# Altium project flyControl.PrjPcb
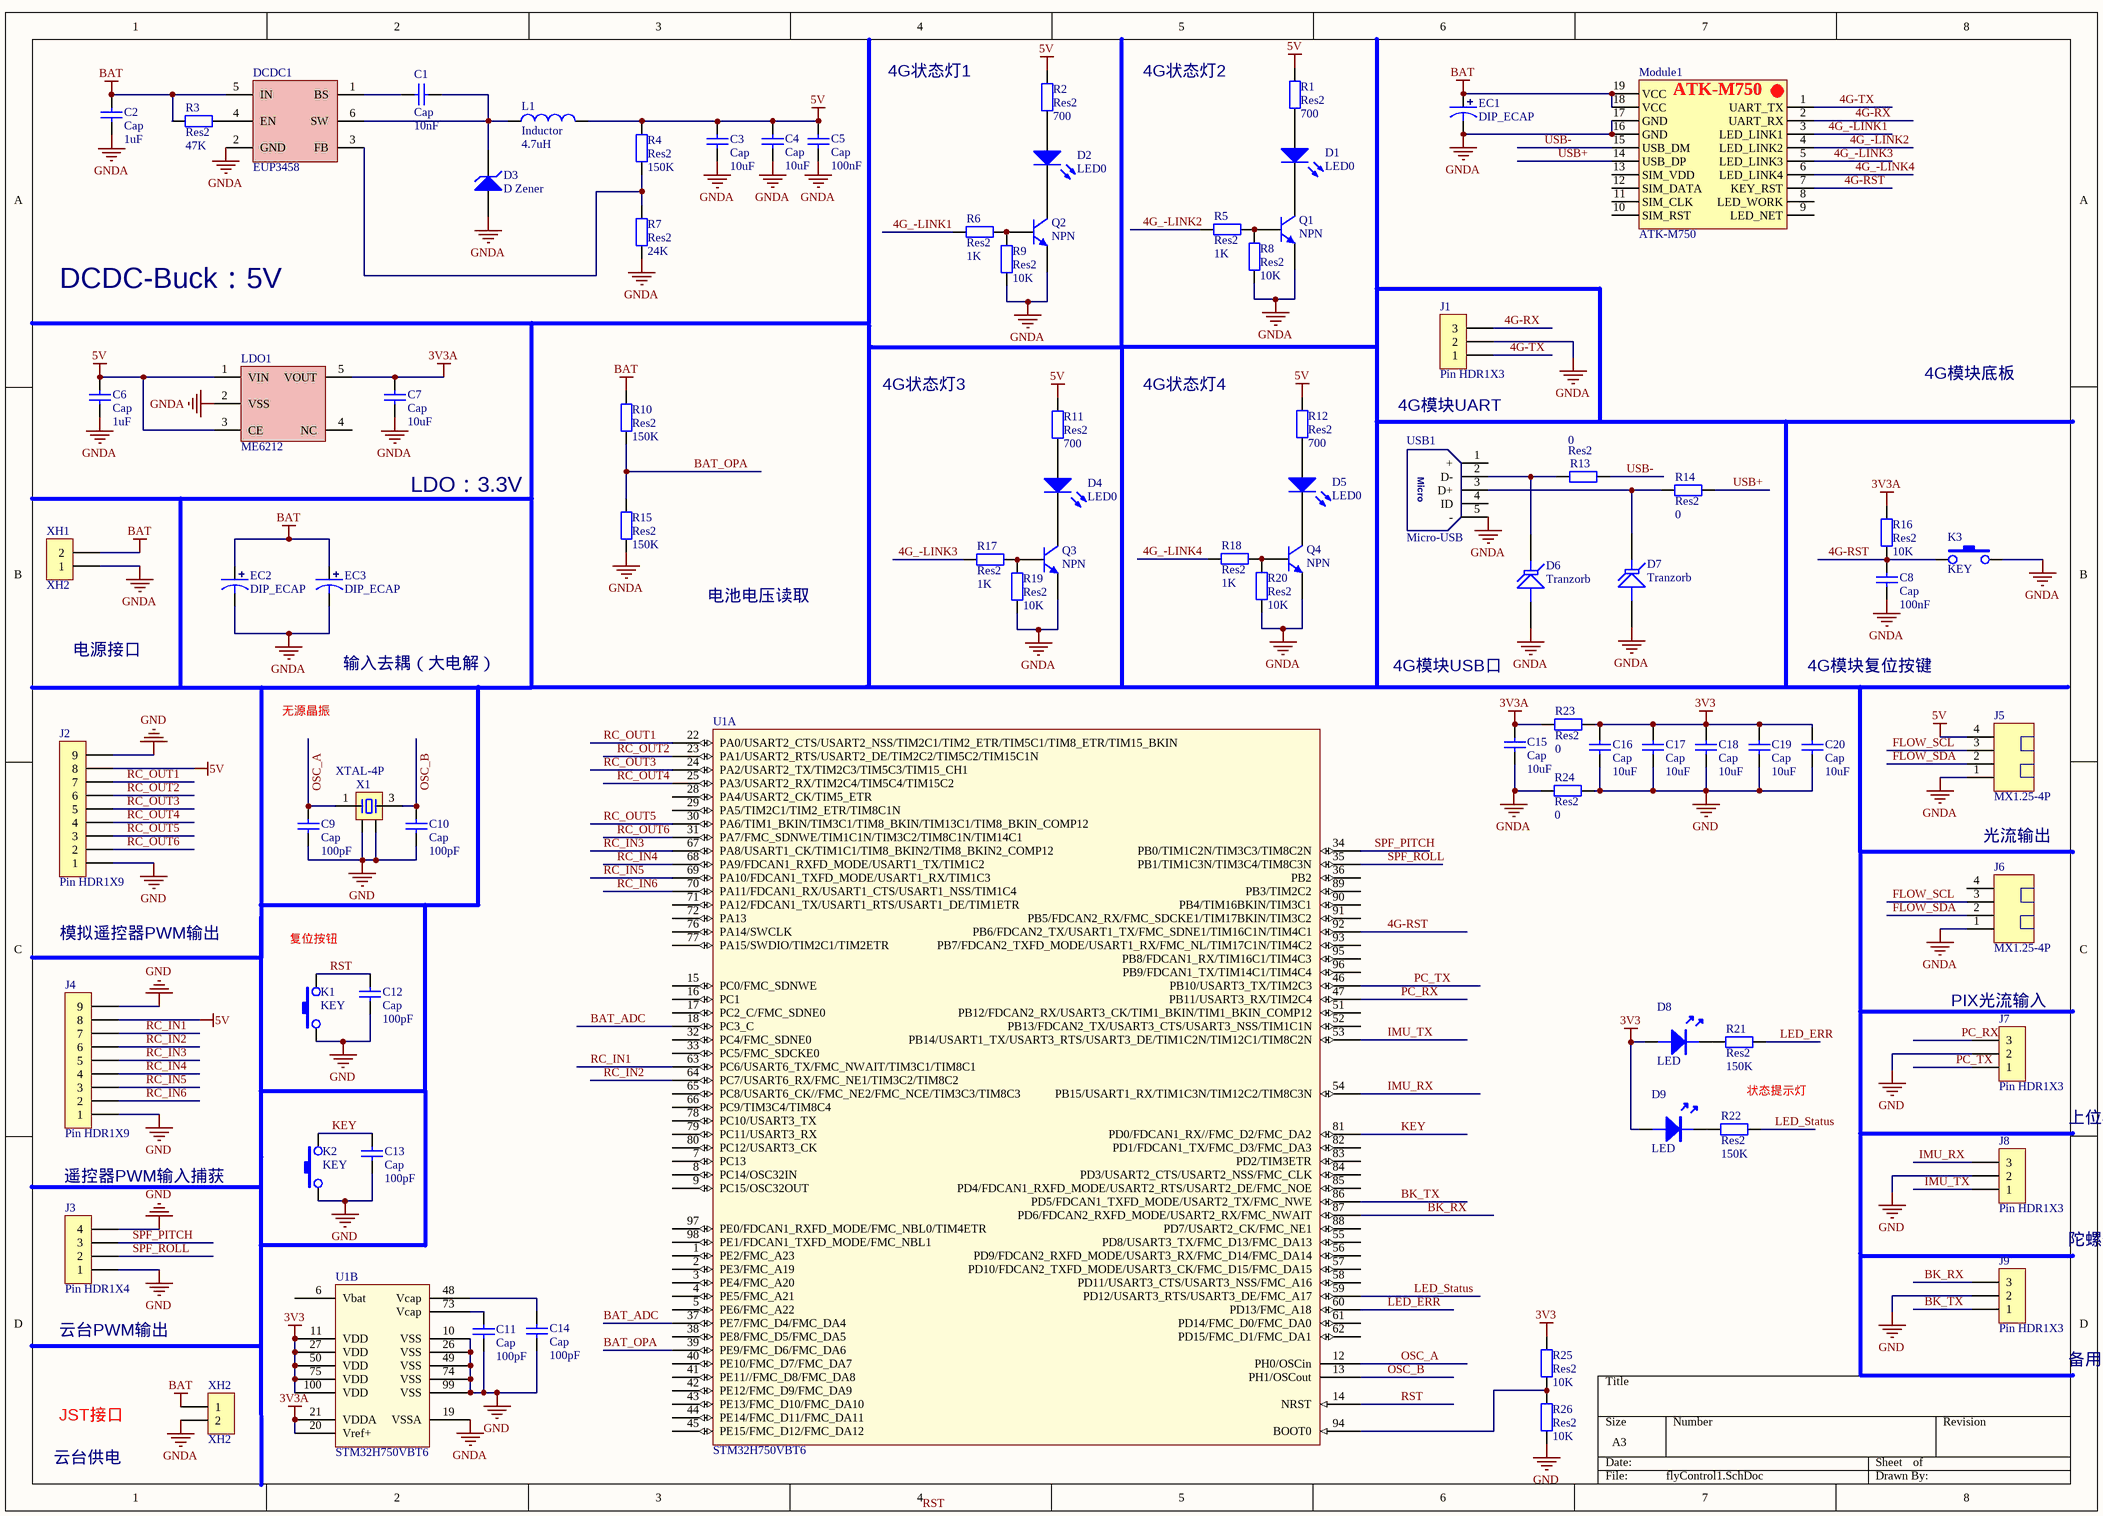
[diagram p0: flyControl1.SchDoc]
1 sheet, 83 parts. Net scope: global (net labels, ports and power ports of the same name join across sheets).
Board file: flyControl1.PcbDoc

## Sheet flyControl1.SchDoc
size A3

### Parts
C1  Cap  value 10nF  [0603C]
C2  Cap  value 1uF  [0805C]
C3  Cap  value 10uF  [0603C]
C4  Cap  value 10uF  [0603C]
C5  Cap  value 100nF  [0603C]
C6  Cap  value 1uF  [0603C]
C7  Cap  value 10uF  [0603C]
C8  Cap  value 100nF  [0603C]
C9  Cap  value 100pF  [0603C]
C10  Cap  value 100pF  [0603C]
C11  Cap  value 100pF  [0603C]
C12  Cap  value 100pF  [0603C]
C13  Cap  value 100pF  [0603C]
C14  Cap  value 100pF  [0603C]
C15  Cap  value 10uF  [0603C]
C16  Cap  value 10uF  [0603C]
C17  Cap  value 10uF  [0603C]
C18  Cap  value 10uF  [0603C]
C19  Cap  value 10uF  [0603C]
C20  Cap  value 10uF  [0603C]
D1  LED0  [LED-0603G]
D2  LED0  [LED-0603G]
D3  D Zener  [SMA/DO-214AC]
D4  LED0  [LED-0603G]
D5  LED0  [LED-0603G]
D6  Tranzorb  [SMA/DO-214AC]
D7  Tranzorb  [SMA/DO-214AC]
D8  LED  [LED-0603G]
D9  LED  [LED-0603G]
DCDC1  EUP3458  [SOT23-6]
EC1  DIP_ECAP  [DIP-EC1.5X4X8]
EC2  DIP_ECAP  [DIP-EC5.0X10X20]
EC3  DIP_ECAP  [DIP-EC5.0X10X20]
J1  Pin HDR1X3  [Pin HDR1X3/2.54mm-W]
J2  Pin HDR1X9  [Pin HDR1X9/2.54mm-W]
J3  Pin HDR1X4  [Pin HDR1X4/2.54mm-W]
J4  Pin HDR1X9  [Pin HDR1X9/2.54mm-W]
J5  MX1.25-4P  [MX1.25WS-4P]
J6  MX1.25-4P  [MX1.25WS-4P]
J7  Pin HDR1X3  [Pin HDR1X3/2.54mm-W]
J8  Pin HDR1X3  [Pin HDR1X3/2.54mm-W]
J9  Pin HDR1X3  [Pin HDR1X3/2.54mm-W]
K1  KEY  [SMD-3X6X2.5]
K2  KEY  [SMD-3X6X2.5]
K3  KEY  [SMD-3X6X2.5]
L1  Inductor  value 4.7uH  [NR3015]
LDO1  ME6212  [SOT23-5]
Module1  ATK-M750  [ATK-M750-V1.0]
Q1  NPN  [SOT-23]
Q2  NPN  [SOT-23]
Q3  NPN  [SOT-23]
Q4  NPN  [SOT-23]
R1  Res2  value 700  [0603R]
R2  Res2  value 700  [0603R]
R3  Res2  value 47K  [0603R]
R4  Res2  value 150K  [0603R]
R5  Res2  value 1K  [0603R]
R6  Res2  value 1K  [0603R]
R7  Res2  value 24K  [0603R]
R8  Res2  value 10K  [0603R]
R9  Res2  value 10K  [0603R]
R10  Res2  value 150K  [0603R]
R11  Res2  value 700  [0603R]
R12  Res2  value 700  [0603R]
R13  Res2  value 0  [0603R]
R14  Res2  value 0  [0603R]
R15  Res2  value 150K  [0603R]
R16  Res2  value 10K  [0603R]
R17  Res2  value 1K  [0603R]
R18  Res2  value 1K  [0603R]
R19  Res2  value 10K  [0603R]
R20  Res2  value 10K  [0603R]
R21  Res2  value 150K  [0603R]
R22  Res2  value 150K  [0603R]
R23  Res2  value 0  [0603R]
R24  Res2  value 0  [0603R]
R25  Res2  value 10K  [0603R]
R26  Res2  value 10K  [0603R]
U1  STM32H750VBT6  [QFP50P1600X1600X160-100N]  (parts A,B of 2)
USB1  Micro-USB  [USB-MICRO_D]
X1  XTAL-4P  [OSC 3225-4P]
XH1  XH2  [XH2/2.54mm/90]
XH2  XH2  [XH2/2.54mm/90]

### Nets
3V3: C16.2 C17.2 C18.2 C19.2 C20.2 D8.A D9.A R23.2 R25.2 U1.11(VDD) U1.27(VDD) U1.50(VDD) U1.75(VDD) U1.100(VDD)
3V3A: C7.2 C15.2 LDO1.5(VOUT) R16.2 R23.1 U1.20(Vref+) U1.21(VDDA)
5V: C3.2 C4.2 C5.2 C6.2 J2.8 J4.8 J5.4 L1.2 LDO1.1(VIN) LDO1.3(CE) R1.2 R2.2 R4.2 R11.2 R12.2
BAT: C2.2 DCDC1.5(IN) EC1.1 EC2.1 EC3.1 Module1.18(VCC) Module1.19(VCC) R3.1 R10.2 XH1.2 XH2.1
GND: C9.2 C10.1 C11.1 C12.1 C13.1 C14.1 C16.1 C17.1 C18.1 C19.1 C20.1 J2.1 J2.9 J3.1 J3.4 J4.1 J4.9 J7.2 J8.2 J9.2 K1.1 K2.1 R24.2 R26.2 U1.10(VSS) U1.26(VSS) U1.49(VSS) U1.74(VSS) U1.99(VSS) X1.2 X1.4
GNDA: C2.1 C3.1 C4.1 C5.1 C6.1 C7.1 C8.1 C15.1 D3.1(A) D6.1(A) D7.1(A) DCDC1.2(GND) EC1.2 EC2.2 EC3.2 J1.2 J5.1 J6.1 K3.3 LDO1.2(VSS) Module1.16(GND) Module1.17(GND) Q1.3(E) Q2.3(E) Q3.3(E) Q4.3(E) R7.1 R8.2 R9.2 R15.1 R19.2 R20.2 R24.1 U1.19(VSSA) USB1.5(-) XH1.1 XH2.2
4G-RST: C8.2 K3.1 Module1.7(KEY_RST) R16.1 U1.92(PB6/FDCAN2_TX/USART1_TX/FMC_SDNE1/TIM16C1N/TIM4C1)
4G-RX: J1.3 Module1.2(UART_RX)
4G-TX: J1.1 Module1.1(UART_TX)
4G_-LINK1: Module1.3(LED_LINK1) R6.2
4G_-LINK2: Module1.4(LED_LINK2) R5.2
4G_-LINK3: Module1.5(LED_LINK3) R17.2
4G_-LINK4: Module1.6(LED_LINK4) R18.2
BAT_ADC: U1.18(PC3_C) U1.37(PE7/FMC_D4/FMC_DA4)
BAT_OPA: R10.1 R15.2 U1.39(PE9/FMC_D6/FMC_DA6)
BK_RX: J9.3 U1.87(PD6/FDCAN2_RXFD_MODE/USART2_RX/FMC_NWAIT)
BK_TX: J9.1 U1.86(PD5/FDCAN1_TXFD_MODE/USART2_TX/FMC_NWE)
FLOW_SCL: J5.3 J6.3
FLOW_SDA: J5.2 J6.2
IMU_RX: J8.3 U1.54(PB15/USART1_RX/TIM1C3N/TIM12C2/TIM8C3N)
IMU_TX: J8.1 U1.53(PB14/USART1_TX/USART3_RTS/USART3_DE/TIM1C2N/TIM12C1/TIM8C2N)
KEY: C13.2 K2.3 U1.81(PD0/FDCAN1_RX//FMC_D2/FMC_DA2)
LED_ERR: R21.1 U1.60(PD13/FMC_A18)
LED_Status: R22.1 U1.59(PD12/USART3_RTS/USART3_DE/FMC_A17)
OSC_A: C9.1 U1.12(PH0/OSCin) X1.1
OSC_B: C10.2 U1.13(PH1/OSCout) X1.3
PC_RX: J7.3 U1.47(PB11/USART3_RX/TIM2C4)
PC_TX: J7.1 U1.46(PB10/USART3_TX/TIM2C3)
RC_IN1: J4.7 U1.63(PC6/USART6_TX/FMC_NWAIT/TIM3C1/TIM8C1)
RC_IN2: J4.6 U1.64(PC7/USART6_RX/FMC_NE1/TIM3C2/TIM8C2)
RC_IN3: J4.5 U1.67(PA8/USART1_CK/TIM1C1/TIM8_BKIN2/TIM8_BKIN2_COMP12)
RC_IN4: J4.4 U1.68(PA9/FDCAN1_RXFD_MODE/USART1_TX/TIM1C2)
RC_IN5: J4.3 U1.69(PA10/FDCAN1_TXFD_MODE/USART1_RX/TIM1C3)
RC_IN6: J4.2 U1.70(PA11/FDCAN1_RX/USART1_CTS/USART1_NSS/TIM1C4)
RC_OUT1: J2.7 U1.22(PA0/USART2_CTS/USART2_NSS/TIM2C1/TIM2_ETR/TIM5C1/TIM8_ETR/TIM15_BKIN)
RC_OUT2: J2.6 U1.23(PA1/USART2_RTS/USART2_DE/TIM2C2/TIM5C2/TIM15C1N)
RC_OUT3: J2.5 U1.24(PA2/USART2_TX/TIM2C3/TIM5C3/TIM15_CH1)
RC_OUT4: J2.4 U1.25(PA3/USART2_RX/TIM2C4/TIM5C4/TIM15C2)
RC_OUT5: J2.3 U1.30(PA6/TIM1_BKIN/TIM3C1/TIM8_BKIN/TIM13C1/TIM8_BKIN_COMP12)
RC_OUT6: J2.2 U1.31(PA7/FMC_SDNWE/TIM1C1N/TIM3C2/TIM8C1N/TIM14C1)
RST: C12.2 K1.3 U1.14(NRST)
SPF_PITCH: J3.3 U1.34(PB0/TIM1C2N/TIM3C3/TIM8C2N)
SPF_ROLL: J3.2 U1.35(PB1/TIM1C3N/TIM3C4/TIM8C3N)
USB+: Module1.14(USB_DP) R14.2
USB-: Module1.15(USB_DM) R13.2
NetC1_1: C1.1 DCDC1.1(BS)
NetC1_2: C1.2 D3.2(K) DCDC1.6(SW) L1.1
NetC11_2: C11.2 U1.73(Vcap)
NetC14_2: C14.2 U1.48(Vcap)
NetD1_1: D1.1(A) R1.1
NetD1_2: D1.2(K) Q1.1(C)
NetD2_1: D2.1(A) R2.1
NetD2_2: D2.2(K) Q2.1(C)
NetD4_1: D4.1(A) R11.1
NetD4_2: D4.2(K) Q3.1(C)
NetD5_1: D5.1(A) R12.1
NetD5_2: D5.2(K) Q4.1(C)
NetD6_2: D6.2(K) R13.1 USB1.2(D-)
NetD7_2: D7.2(K) R14.1 USB1.3(D+)
NetD8_K: D8.K R21.2
NetD9_K: D9.K R22.2
NetDCDC1_3: DCDC1.3(FB) R4.1 R7.2
NetDCDC1_4: DCDC1.4(EN) R3.2
NetQ1_2: Q1.2(B) R5.1 R8.1
NetQ2_2: Q2.2(B) R6.1 R9.1
NetQ3_2: Q3.2(B) R17.1 R19.1
NetQ4_2: Q4.2(B) R18.1 R20.1
NetR25_1: R25.1 R26.1 U1.94(BOOT0)

Not connected (* = marked no-connect by the designer): J6 4; LDO1 4(NC); Module1 8(LED_WORK) 9(LED_NET) 10(SIM_RST) 11(SIM_CLK) 12(SIM_DATA) 13(SIM_VDD); U1 1(PE2/FMC_A23) 2(PE3/FMC_A19) 3(PE4/FMC_A20) 4(PE5/FMC_A21) 5(PE6/FMC_A22) 6(Vbat) 7(PC13) 8(PC14/OSC32IN) 9(PC15/OSC32OUT) 15(PC0/FMC_SDNWE) 16(PC1) 17(PC2_C/FMC_SDNE0) 28(PA4/USART2_CK/TIM5_ETR) 29(PA5/TIM2C1/TIM2_ETR/TIM8C1N) 32(PC4/FMC_SDNE0) 33(PC5/FMC_SDCKE0) 36(PB2) 38(PE8/FMC_D5/FMC_DA5) 40(PE10/FMC_D7/FMC_DA7) 41(PE11//FMC_D8/FMC_DA8) 42(PE12/FMC_D9/FMC_DA9) 43(PE13/FMC_D10/FMC_DA10) 44(PE14/FMC_D11/FMC_DA11) 45(PE15/FMC_D12/FMC_DA12) 51(PB12/FDCAN2_RX/USART3_CK/TIM1_BKIN/TIM1_BKIN_COMP12) 52(PB13/FDCAN2_TX/USART3_CTS/USART3_NSS/TIM1C1N) 55(PD8/USART3_TX/FMC_D13/FMC_DA13) 56(PD9/FDCAN2_RXFD_MODE/USART3_RX/FMC_D14/FMC_DA14) 57(PD10/FDCAN2_TXFD_MODE/USART3_CK/FMC_D15/FMC_DA15) 58(PD11/USART3_CTS/USART3_NSS/FMC_A16) 61(PD14/FMC_D0/FMC_DA0) 62(PD15/FMC_D1/FMC_DA1) 65(PC8/USART6_CK//FMC_NE2/FMC_NCE/TIM3C3/TIM8C3) 66(PC9/TIM3C4/TIM8C4) 71(PA12/FDCAN1_TX/USART1_RTS/USART1_DE/TIM1ETR) 72(PA13) 76(PA14/SWCLK) 77(PA15/SWDIO/TIM2C1/TIM2ETR) 78(PC10/USART3_TX) 79(PC11/USART3_RX) 80(PC12/USART3_CK) 82(PD1/FDCAN1_TX/FMC_D3/FMC_DA3) 83(PD2/TIM3ETR) 84(PD3/USART2_CTS/USART2_NSS/FMC_CLK) 85(PD4/FDCAN1_RXFD_MODE/USART2_RTS/USART2_DE/FMC_NOE) 88(PD7/USART2_CK/FMC_NE1) 89(PB3/TIM2C2) 90(PB4/TIM16BKIN/TIM3C1) 91(PB5/FDCAN2_RX/FMC_SDCKE1/TIM17BKIN/TIM3C2) 93(PB7/FDCAN2_TXFD_MODE/USART1_RX/FMC_NL/TIM17C1N/TIM4C2) 95(PB8/FDCAN1_RX/TIM16C1/TIM4C3) 96(PB9/FDCAN1_TX/TIM14C1/TIM4C4) 97(PE0/FDCAN1_RXFD_MODE/FMC_NBL0/TIM4ETR) 98(PE1/FDCAN1_TXFD_MODE/FMC_NBL1); USB1 1(+) 4(ID)

### Notes on the sheet
- 4G状态灯1
- 4G状态灯2
- DCDC-Buck：5V
- 4G状态灯3
- 4G状态灯4
- 4G模块底板
- 4G模块UART
- LDO：3.3V
- 电源接口
- 电池电压读取
- 无源晶振
- 输入去耦（大电解）
- 4G模块USB口
- 4G模块复位按键
- 光流输出
- 模拟遥控器PWM输出
- (near K1) 复位按钮
- (near J7) PIX光流输入
- 状态提示灯
- 上位机UART
- 遥控器PWM输入捕获
- 陀螺仪UART
- (near J3) 云台PWM输出
- (near J9) 备用UART
- 云台供电
- JST接口
- Labels drawn without touching a wire or pin: RST
- (in symbol Micro-USB) Micro

### Library data of the parts
C1-C20 = Cap: Capacitor; Published: 8-Jun-2000; LatestRevisionDate: 17-Jul-2002; LatestRevisionNote: Re-released for DXP Platform.; PackageReference: RAD-0.3; Publisher: Altium Limited; PackageDescription: Radial Cap, Thru-Hole; 2 Leads; 0.3 in Pin Spacing
D1 D2 D4 D5 = LED0: Typical INFRARED GaAs LED; pin to pad: 1>A 2>K; Published: 8-Jun-2000; LatestRevisionDate: 08-Jul-2005; LatestRevisionNote: Mech Layer 1 removed.; PackageReference: LED-0; Publisher: Altium Limited; PackageDescription: LED; 2 Leads
D3 = D Zener: Zener Diode; pin to pad: 1>A 2>K; Published: 8-Jun-2000; LatestRevisionDate: 17-Jul-2002; LatestRevisionNote: Re-released for DXP Platform.; PackageReference: DIODE-0.7; Publisher: Altium Limited; PackageDescription: Diode, Thru-Hole; 2 Leads; 0.7 in Pin Spacing
D6 D7 = Tranzorb: Transient Voltage Suppression (TVS) Diode; pin to pad: 1>A 2>K; Published: 24-Mar-1999; LatestRevisionDate: 17-Jul-2002; LatestRevisionNote: Re-released for DXP Platform.; PackageReference: DO-7; Publisher: Altium Limited; PackageDescription: Axial Lead Diode
D8 D9 = LED: pin to pad: 1>A 2>K
DCDC1 = EUP3458: 同步DCDC，30Vmax，1.2MHz，输出最大15V@1.2A
EC1-EC3 = DIP_ECAP: 直插电解电容
J5 J6 = MX1.25-4P: pin to pad: 1>4 2>3 3>2 4>1
L1 = Inductor: Code_IEC: 1005; Published: 8-Jun-2000; LatestRevisionDate: 29-May-2009; LatestRevisionNote: IPC-7351 Footprint Added.; PackageReference: 0402-A; Publisher: Altium Limited; PackageDescription: Chip Inductor; Code_JEITA: 0402
LDO1 = ME6212: 3.3V小体积LDO，最大电流350mA
Module1 = ATK-M750: 正点原子ATK-M750(4G DTU)
Q1-Q4 = NPN: NPN Bipolar Transistor; pin to pad: 1>C 2>B 3>E; Published: 8-Jun-2000; LatestRevisionDate: 17-Jul-2002; LatestRevisionNote: Re-released for DXP Platform.; PackageReference: TO-226-AA; Publisher: Altium Limited; PackageDescription: TO, Flat Index; 3 In-Line, Axial Leads; Body Dia. 4.8mm; Leads 0.55 x 0.51 mm (max); Code_JEDEC: TO-226-AA
R1-R26 = Res2: Resistor; Published: 8-Jun-2000; LatestRevisionDate: 17-Jul-2002; LatestRevisionNote: Re-released for DXP Platform.; PackageReference: AXIAL-0.4; Publisher: Altium Limited; PackageDescription: Axial Device, Thru-Hole; 2 Leads; 0.4 in Pin Spacing
X1 = XTAL-4P: 4脚无源晶振
XH1 = XH2: pin to pad: 1>2 2>1